# EasyEDA Pro project PRJ_Feeder.epro, schematic Rail
Board Name: Rail; Create Date: 2025-01-08; Page Name: Rail; Project Name: Orion-Feeder; Schematic Name: Rail; Update Date: 2025-01-09; Company: EasyEDA.com; Page Size: A4; Version: V0.1b
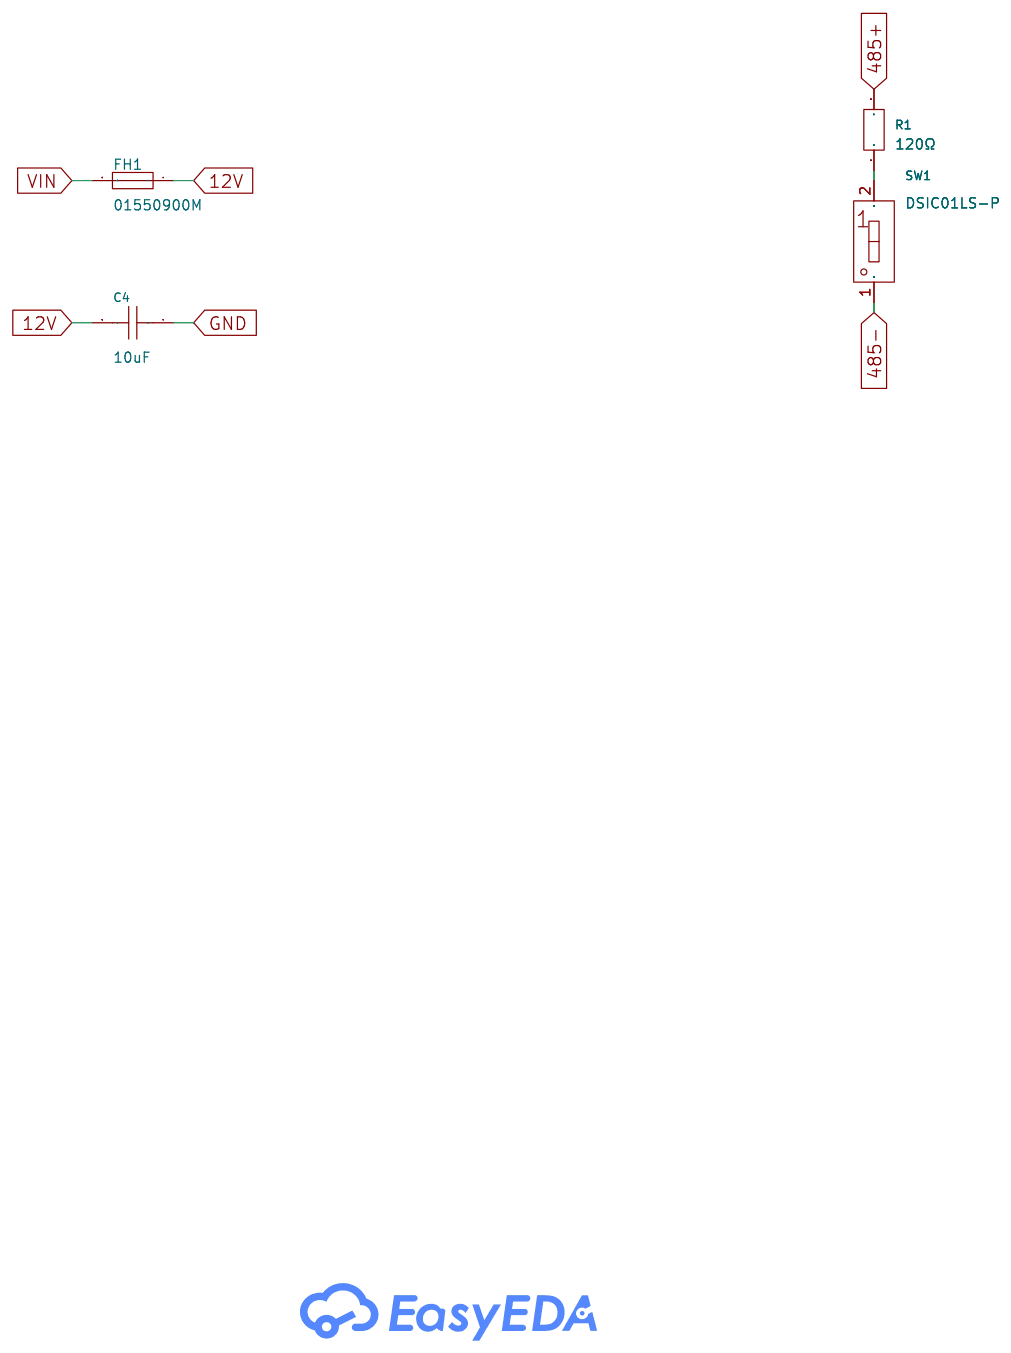
[diagram p5: schematic sheet]

## Parts
C4  10uF  [C0603]
FH1  01550900M  [FUSE-SMD_L9.8-W5.0]
R1  120Ω  [R0402]
SW1  DSIC01LS-P  [SW-SMD_2P-L3.5-W6.2-P2.54-LS9.8]

## Library data of the parts
C4 = GRM188R61E106KA73D: Capacitance: Tolerance:±10% Tolerance:±10% Voltage Rated: Temperature Coefficient:; LCSC Part Name: 10uF ±10% 25V; Supplier Part: C344022; Manufacturer: muRata(村田); Supplier Footprint: 0603; JLCPCB Part Class: Extended Part; Datasheet: https://atta.szlcsc.com/upload/public/pdf/source/20181211/C344022_BB98D43E7DA95E5A749FBFE073C8A3E0.pdf; Supplier: LCSC; Tolerance: ±10%
FH1 = 01550900M: Fuseholder Type:- Fuse Type:- Fuse Size:-; Supplier Part: C108518; Manufacturer: Littelfuse(美国力特); Supplier Footprint: SMD,5.0x9.7mm; JLCPCB Part Class: Extended Part; Datasheet: https://atta.szlcsc.com/upload/public/pdf/source/20181031/C315847_D8C8759CD5ED576C0EA975A2D5312378.pdf; Supplier: LCSC
R1 = ERJ2GEJ121X: Type:Thick Film Resistors Resistance: Tolerance:±5% Tolerance:±5% Power(Watts): Overload Voltage (Max):- Temperature Coefficient:±200ppm/℃ Temperature Coefficient:±200ppm/℃ Operating Temperature Range:-55℃~+155℃ Operating Temperature Range:-55℃~+155℃; LCSC Part Name: 120Ω ±5% 100mW 厚膜电阻; Supplier Part: C412974; Manufacturer: PANASONIC(松下); Supplier Footprint: 0402; JLCPCB Part Class: Extended Part; Datasheet: https://atta.szlcsc.com/upload/public/pdf/source/20190820/C412974_078D0C135EE48A01219A288E454FDF0F.pdf; Supplier: LCSC; Type: Thick Film Resistors; Tolerance: ±5%; Temperature Coefficient: ±200ppm/℃; Operating Temperature Range: -55℃~+155℃
SW1 = DSIC01LS-P_C600988: Type:平拨,凸起式 Circuit:SPST Number of Positions:1Bit Pin Style:Gull Wing Lead Pitch:- Current Rating:25mA Voltage Rating:24V Operating Temperature:-20℃~+70℃ Operating Temperature:-20℃~+70℃ Operating Life:3千次 Color:Black; LCSC Part Name: 平拨,凸起式 1位拨码开关; Supplier Part: C600988; Manufacturer: XKB Connectivity(中国星坤); Supplier Footprint: SMD,3.5x6.2mm; JLCPCB Part Class: Extended Part; Datasheet: https://atta.szlcsc.com/upload/public/pdf/source/20181029/C319044_89B44386426E378AA9595AB22F0589AA.pdf; Supplier: LCSC; Type: 平拨,凸起式; Circuit: SPST; Number of Positions: 1Bit; Pin Style: Gull Wing; Current Rating: 25mA; Voltage Rating: 24V; Operating Temperature: -20℃~+70℃; Operating Life: 3千次; Color: Black

## Nets
12V: C4.2 FH1.1
GND: C4.1
VIN: FH1.2
485+: R1.2
485-: SW1.1(PIN1)
$1N358: R1.1 SW1.2(PIN2)
